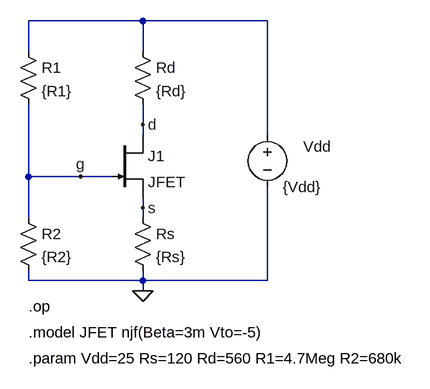
[diagram p0: schematic FET03op.asc]
FET03op.asc, the LTspice schematic file:
Version 4
SHEET 1 1608 1076
WIRE 192 -128 16 -128
WIRE 384 -128 192 -128
WIRE 16 -80 16 -128
WIRE 192 -80 192 -128
WIRE 192 32 192 0
WIRE 192 48 192 32
WIRE 384 48 384 -128
WIRE 16 112 16 0
WIRE 96 112 16 112
WIRE 144 112 96 112
WIRE 192 160 192 144
WIRE 16 176 16 112
WIRE 192 176 192 160
WIRE 16 272 16 256
WIRE 192 272 192 256
WIRE 192 272 16 272
WIRE 384 272 384 128
WIRE 384 272 192 272
WIRE 192 288 192 272
FLAG 192 288 0
FLAG 96 112 g
FLAG 192 32 d
FLAG 192 160 s
SYMBOL njf 144 48 R0
SYMATTR InstName J1
SYMATTR Value JFET
SYMBOL voltage 384 32 R0
WINDOW 0 55 34 Left 2
WINDOW 123 0 0 Left 0
WINDOW 39 0 0 Left 0
SYMATTR InstName Vdd
SYMATTR Value {Vdd}
SYMBOL res 176 -96 R0
SYMATTR InstName Rd
SYMATTR Value {Rd}
SYMBOL res 176 160 R0
SYMATTR InstName Rs
SYMATTR Value {Rs}
SYMBOL res 0 -96 R0
SYMATTR InstName R1
SYMATTR Value {R1}
SYMBOL res 0 160 R0
SYMATTR InstName R2
SYMATTR Value {R2}
TEXT 16 312 Left 2 !.op
TEXT 16 352 Left 2 !.model JFET njf(Beta=3m Vto=-5)
TEXT 16 392 Left 2 !.param Vdd=25 Rs=120 Rd=560 R1=4.7Meg R2=680k

The netlist it stands for:
* FET03op.asc
J1 d g s JFET
Vdd N001 0 {Vdd}
Rd N001 d {Rd}
Rs s 0 {Rs}
R1 N001 g {R1}
R2 g 0 {R2}
.model NJF NJF
.model PJF PJF
.lib standard.jft
.op
.model JFET njf(Beta=3m Vto=-5)
.param Vdd=25 Rs=120 Rd=560 R1=4.7Meg R2=680k
.backanno
.end